# EAGLE schematic Arduino Robotics Camp Tank (EAGLE 7.4.0)
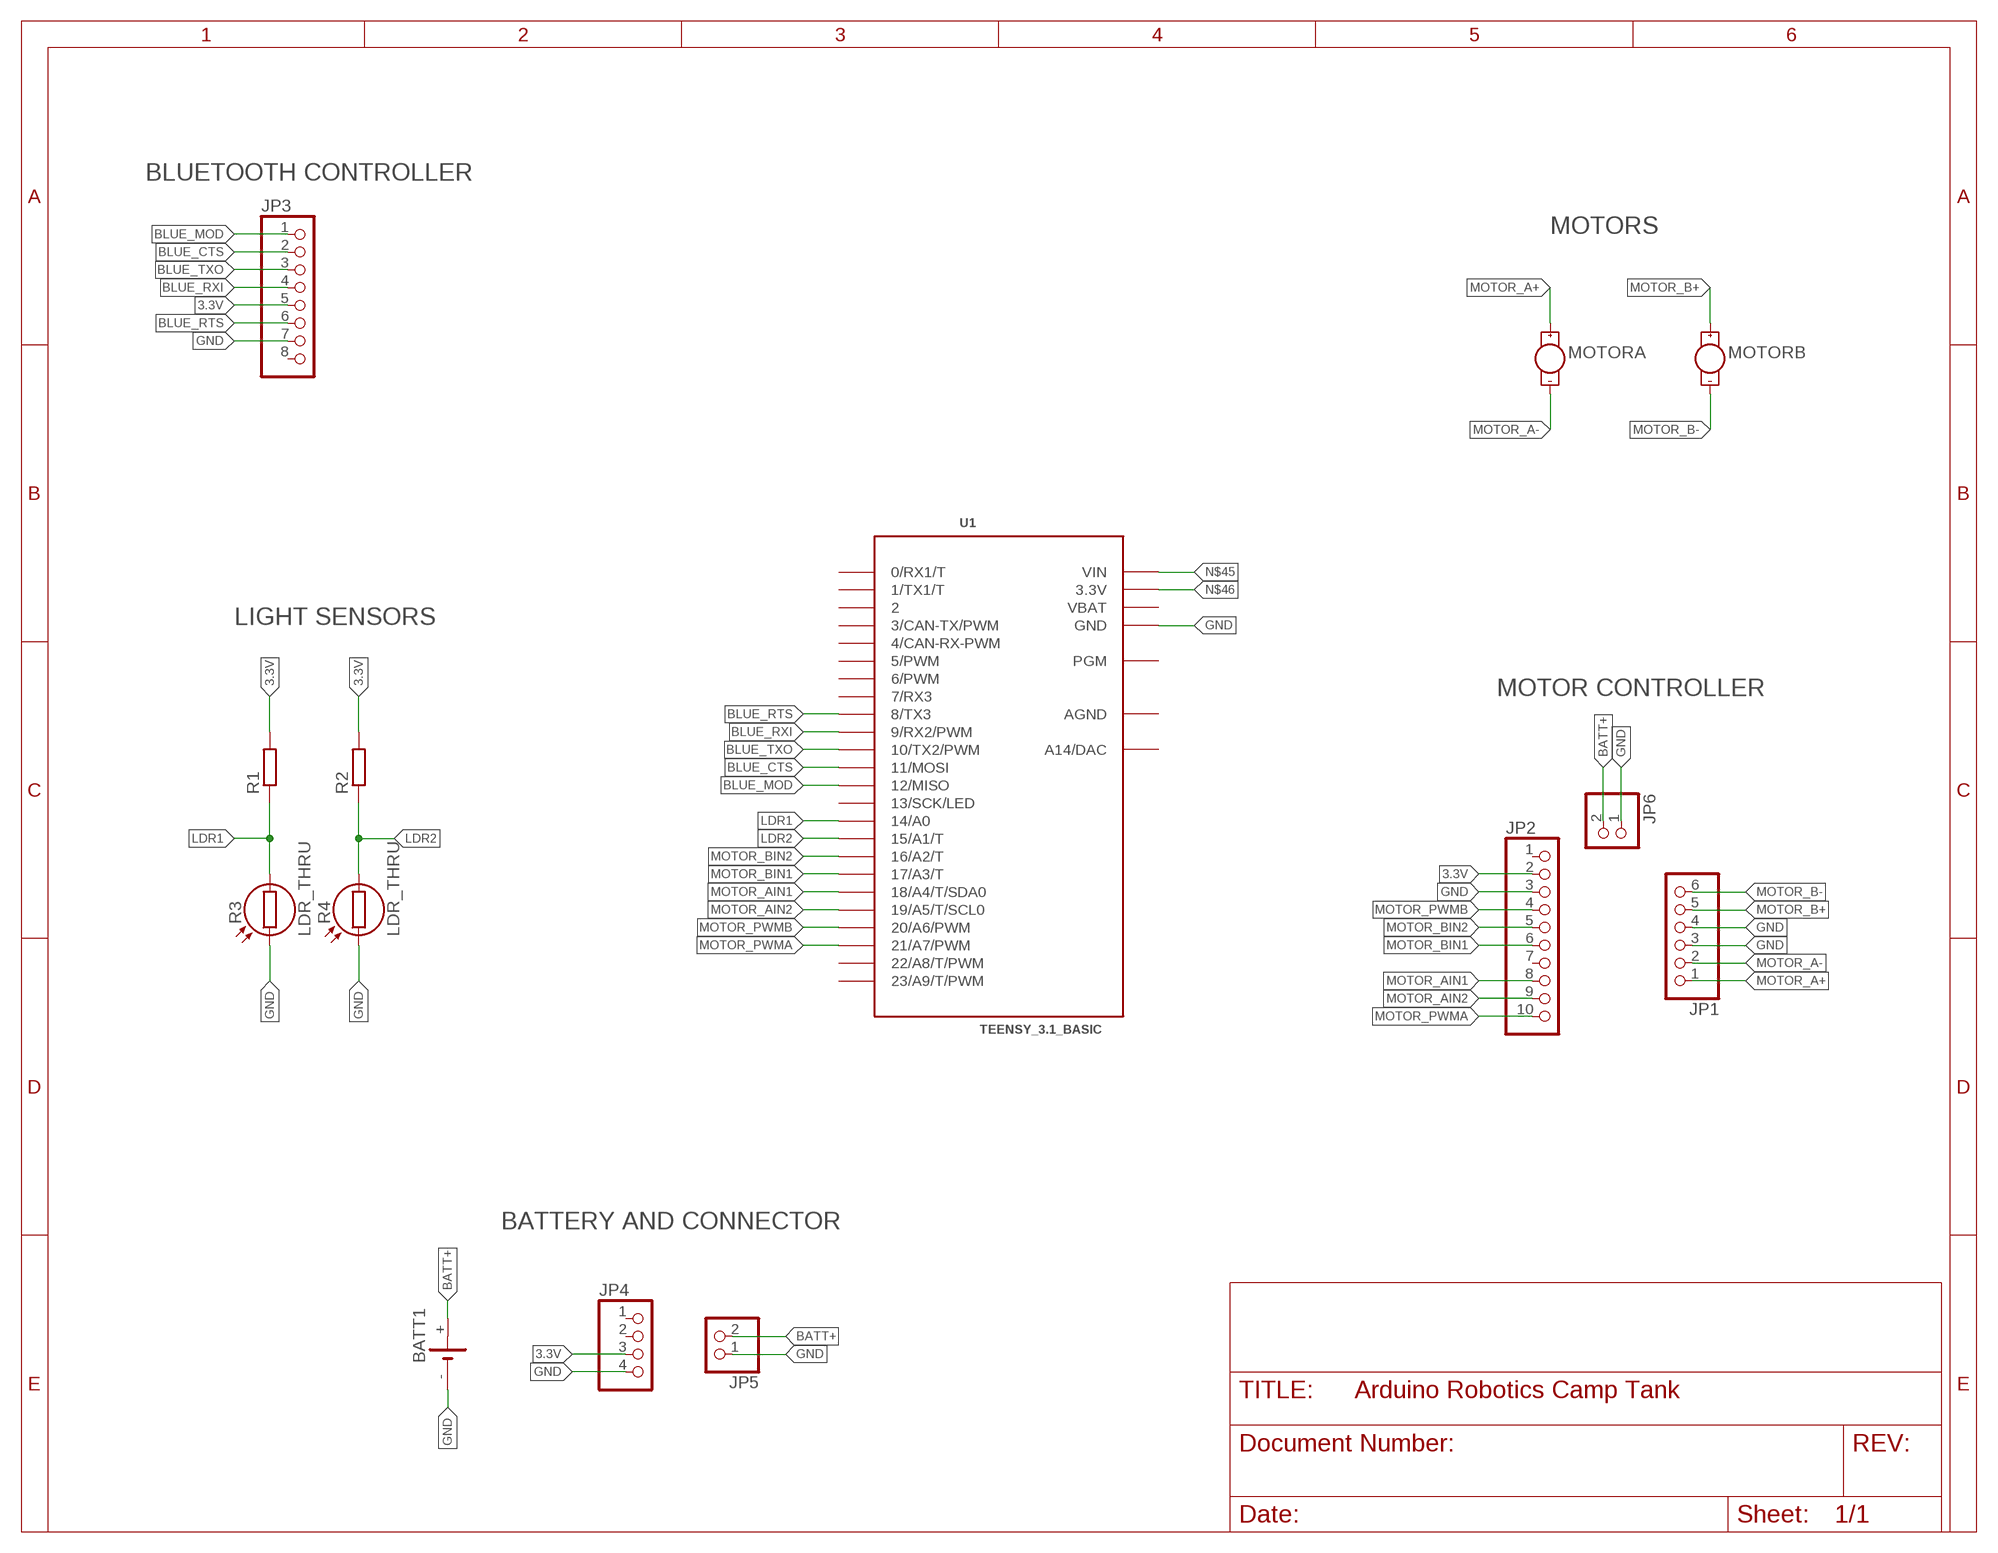
[diagram p0: schematic, sheet 1]

## Parts
BATT1  BATT_9V  [9V_CONNECTOR]
JP1  PINHD-1X6  [1X06]
JP2  PINHD-1X10  [1X10]
JP3  PINHD-1X8  [1X08]
JP4  PINHD-1X4  [1X04]
JP5  PINHD-1X2  [1X02]
JP6  PINHD-1X2  [1X02]
MOTORA  MOTOR10MM  [VIBE-MOTOR-10MM]
MOTORB  MOTOR10MM  [VIBE-MOTOR-10MM]
R1  R-EU_0204/7  [0204/7]
R2  R-EU_0204/7  [0204/7]
R3  LDR_THRU  [LDR]
R4  LDR_THRU  [LDR]
U1  TEENSY_3.1_BASIC  [TEENSY_3.1_BASIC]

## Nets
3.3V: JP2.2 JP3.5 JP4.3 R1.2 R2.2
BATT+: BATT1.+ JP5.2 JP6.2
BLUE_CTS: JP3.2 U1.11(11/MOSI)
BLUE_MOD: JP3.1 U1.12(12/MISO)
BLUE_RTS: JP3.6 U1.8(8/TX3)
BLUE_RXI: JP3.4 U1.9(9/RX2/PWM)
BLUE_TXO: JP3.3 U1.10(10/TX2/PWM)
GND: BATT1.- JP1.3 JP1.4 JP2.3 JP3.7 JP4.4 JP5.1 JP6.1 R3.1 R4.1 U1.GND U1.GND1(GND)
LDR1: R1.1 R3.2 U1.14/A0
LDR2: R2.1 R4.2 U1.15/A1(15/A1/T)
MOTOR_A+: JP1.1 MOTORA.+
MOTOR_A-: JP1.2 MOTORA.-
MOTOR_AIN1: JP2.8 U1.18/A4(18/A4/T/SDA0)
MOTOR_AIN2: JP2.9 U1.19/A5(19/A5/T/SCL0)
MOTOR_B+: JP1.5 MOTORB.+
MOTOR_B-: JP1.6 MOTORB.-
MOTOR_BIN1: JP2.6 U1.17/A3(17/A3/T)
MOTOR_BIN2: JP2.5 U1.16/A2(16/A2/T)
MOTOR_PWMA: JP2.10 U1.21/A7(21/A7/PWM)
MOTOR_PWMB: JP2.4 U1.20/A6(20/A6/PWM)
N$45: U1.VIN
N$46: U1.3.3V U1.3.3V1(3.3V)
Unconnected: JP2.1 JP2.7 JP3.8 JP4.1 JP4.2 U1.0(0/RX1/T) U1.1(1/TX1/T) U1.2 U1.3(3/CAN-TX/PWM) U1.4(4/CAN-RX-PWM) U1.5(5/PWM) U1.6(6/PWM) U1.7(7/RX3) U1.13(13/SCK/LED) U1.22/A8(22/A8/T/PWM) U1.23/A9(23/A9/T/PWM) U1.A14(A14/DAC) U1.PGM

## Notes on the sheet
- BLUETOOTH CONTROLLER
- MOTORS
- LIGHT SENSORS
- MOTOR CONTROLLER
- BATTERY AND CONNECTOR

## Power pins joined to a net without a drawn wire
AGND: U1.AGND
VBAT: U1.VBAT

## Library data of the parts
BATT1 = personal:BATT_9V
JP1 = pinhead:PINHD-1X6: PIN HEADER
JP2 = pinhead:PINHD-1X10: PIN HEADER
JP3 = pinhead:PINHD-1X8: PIN HEADER
JP4 = pinhead:PINHD-1X4: PIN HEADER
JP5 JP6 = pinhead:PINHD-1X2: PIN HEADER
MOTORA MOTORB = SparkFun-Electromechanical:MOTOR: Vibration Motor- ROB-08449 Physical dimension and wire connections for this powerful vibration motor. Motor has a self adhesive backing.
R1 R2 = rcl:R-EU_: RESISTOR, European symbol
R3 R4 = personal:LDR_THRU
U1 = Teensy_3_Series_Board_v1.0:TEENSY_3.1_BASIC: Footprint for Teensy 3.1 board using all pin connections on the outer perimeter